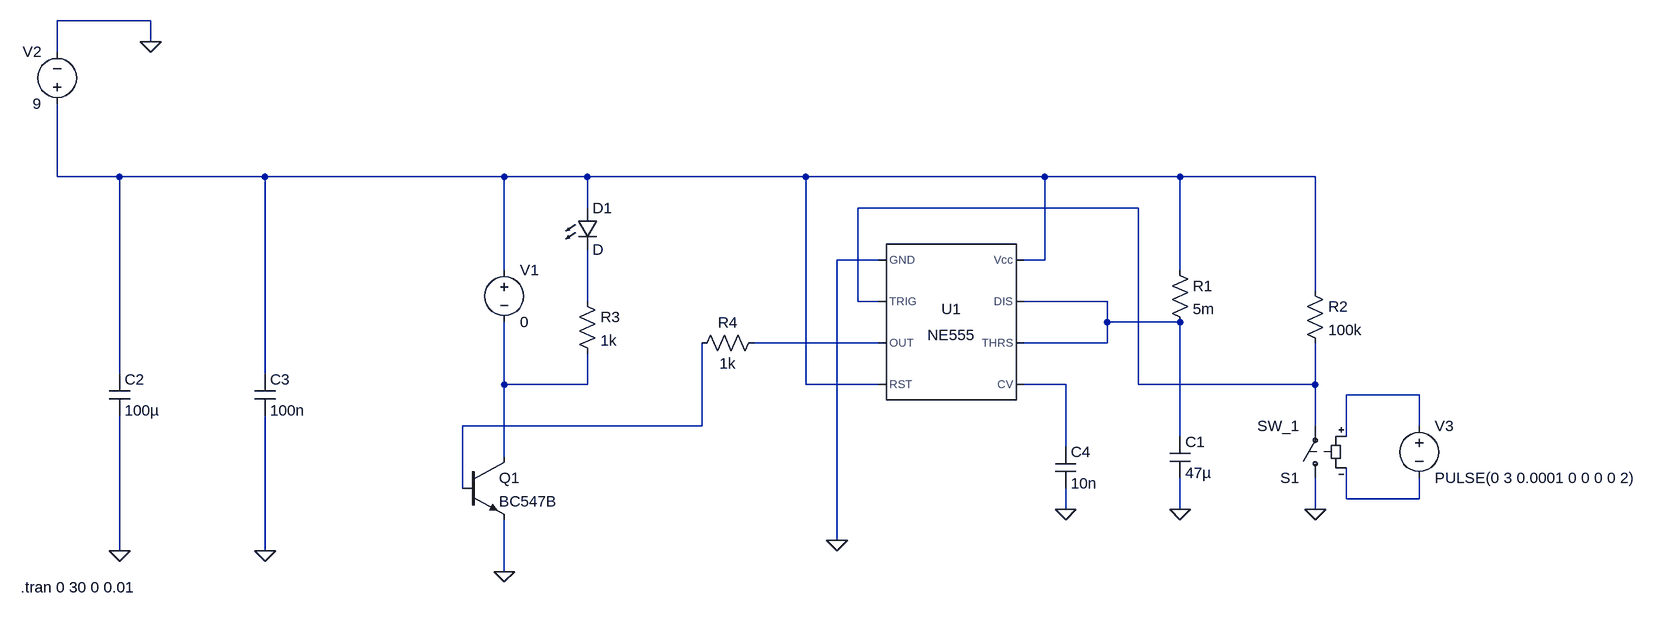
[diagram p0: schematic nodota.asc]
nodota.asc, the LTspice schematic file:
Version 4
SHEET 1 1668 680
WIRE -864 -528 -1008 -528
WIRE -864 -496 -864 -528
WIRE -1008 -480 -1008 -528
WIRE -1008 -288 -1008 -400
WIRE -912 -288 -1008 -288
WIRE -688 -288 -912 -288
WIRE -320 -288 -688 -288
WIRE -192 -288 -320 -288
WIRE 144 -288 -192 -288
WIRE 512 -288 144 -288
WIRE 720 -288 512 -288
WIRE 928 -288 720 -288
WIRE -192 -240 -192 -288
WIRE 656 -240 224 -240
WIRE 256 -160 192 -160
WIRE 512 -160 512 -288
WIRE 512 -160 480 -160
WIRE -320 -144 -320 -288
WIRE 720 -144 720 -288
WIRE 928 -112 928 -288
WIRE -192 -96 -192 -176
WIRE 224 -96 224 -240
WIRE 256 -96 224 -96
WIRE 608 -96 480 -96
WIRE 608 -64 608 -96
WIRE 720 -64 608 -64
WIRE 256 -32 64 -32
WIRE 608 -32 608 -64
WIRE 608 -32 480 -32
WIRE -912 16 -912 -288
WIRE -688 16 -688 -288
WIRE -320 32 -320 -64
WIRE -192 32 -192 -16
WIRE -192 32 -320 32
WIRE 144 32 144 -288
WIRE 256 32 144 32
WIRE 544 32 480 32
WIRE 656 32 656 -240
WIRE 928 32 928 -32
WIRE 928 32 656 32
WIRE 1088 48 976 48
WIRE -16 96 -16 -32
WIRE -16 96 -384 96
WIRE 928 96 928 32
WIRE 1088 96 1088 48
WIRE 720 112 720 -64
WIRE 976 112 976 48
WIRE 544 128 544 32
WIRE -320 144 -320 32
WIRE -384 192 -384 96
WIRE 976 208 976 160
WIRE 1088 208 1088 176
WIRE 1088 208 976 208
WIRE 544 224 544 192
WIRE 720 224 720 176
WIRE 928 224 928 176
WIRE 192 272 192 -160
WIRE -912 288 -912 80
WIRE -688 288 -688 80
WIRE -320 320 -320 240
FLAG 928 224 0
FLAG 720 224 0
FLAG -320 320 0
FLAG -688 288 0
FLAG -912 288 0
FLAG -864 -496 0
FLAG 192 272 0
FLAG 544 224 0
SYMBOL Misc\\NE555 368 -64 R0
SYMATTR InstName U1
SYMBOL res 912 -128 R0
SYMATTR InstName R2
SYMATTR Value 100k
SYMBOL res 704 -160 R0
SYMATTR InstName R1
SYMATTR Value 5m
SYMBOL cap 704 112 R0
SYMATTR InstName C1
SYMATTR Value 47µ
SYMBOL LED -208 -240 R0
SYMATTR InstName D1
SYMBOL res -208 -112 R0
SYMATTR InstName R3
SYMATTR Value 1k
SYMBOL res 80 -48 R90
WINDOW 0 0 56 VBottom 2
WINDOW 3 32 56 VTop 2
SYMATTR InstName R4
SYMATTR Value 1k
SYMBOL npn -384 144 R0
SYMATTR InstName Q1
SYMATTR Value BC547B
SYMBOL voltage -320 -160 R0
SYMATTR InstName V1
SYMATTR Value 0
SYMBOL cap -928 16 R0
SYMATTR InstName C2
SYMATTR Value 100µ
SYMBOL cap -704 16 R0
SYMATTR InstName C3
SYMATTR Value 100n
SYMBOL voltage -1008 -384 R180
WINDOW 0 24 96 Left 2
WINDOW 3 24 16 Left 2
WINDOW 123 0 0 Left 0
WINDOW 39 0 0 Left 0
SYMATTR InstName V2
SYMATTR Value 9
SYMBOL cap 528 128 R0
SYMATTR InstName C4
SYMATTR Value 10n
SYMBOL sw 928 192 R180
SYMATTR InstName S1
SYMATTR Value SW_1
SYMBOL voltage 1088 80 R0
WINDOW 123 0 0 Left 0
WINDOW 39 0 0 Left 0
SYMATTR InstName V3
SYMATTR Value PULSE(0 3 0.0001 0 0 0 0 2)
TEXT -1064 344 Left 2 !.tran 0 30 0 0.01

The netlist it stands for:
* nodota.asc
XU1 0 N002 N005 N001 N007 N004 N004 N001 NE555  ; pins GND TRIG OUT RST CV THRS DIS Vcc
R2 N001 N002 100k
R1 N001 N004 5m
C1 N004 0 47µ
D1 N001 N003 D
R3 N003 N006 1k
R4 N005 N009 1k
Q1 N006 N009 0 0 BC547B
V1 N001 N006 0
C2 N001 0 100µ
C3 N001 0 100n
V2 N001 0 9
C4 N007 0 10n
S1 0 N002 N008 N010 SW_1
V3 N008 N010 PULSE(0 3 0.0001 0 0 0 0 2)
.model D D
.lib standard.dio
.model NPN NPN
.model PNP PNP
.lib standard.bjt
.tran 0 30 0 0.01
.lib NE555.sub
.backanno
.end